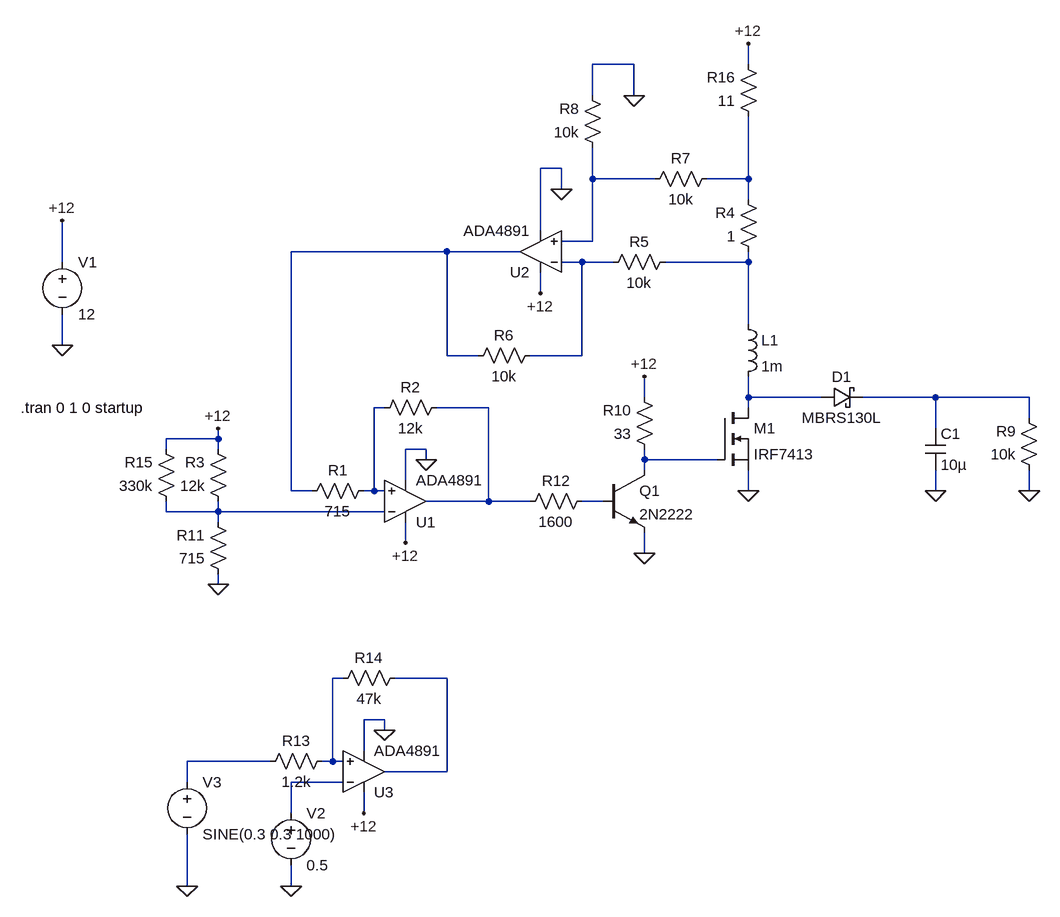
[diagram p0: schematic QuantumDriver.asc]
QuantumDriver.asc, the LTspice schematic file:
Version 4.1
SHEET 1 2180 868
WIRE 1056 -416 992 -416
WIRE 1232 -416 1232 -448
WIRE 992 -368 992 -416
WIRE 1056 -368 1056 -416
WIRE 944 -256 912 -256
WIRE 992 -240 992 -288
WIRE 1088 -240 992 -240
WIRE 1232 -240 1232 -336
WIRE 1232 -240 1168 -240
WIRE 944 -224 944 -256
WIRE 1232 -208 1232 -240
WIRE 912 -160 912 -256
WIRE 992 -144 992 -240
WIRE 992 -144 944 -144
WIRE 768 -128 528 -128
WIRE 880 -128 768 -128
WIRE 176 -112 176 -176
WIRE 976 -112 944 -112
WIRE 1024 -112 976 -112
WIRE 1232 -112 1232 -128
WIRE 1232 -112 1104 -112
WIRE 912 -64 912 -96
WIRE 1232 -16 1232 -112
WIRE 176 16 176 -32
WIRE 768 32 768 -128
WIRE 816 32 768 32
WIRE 976 32 976 -112
WIRE 976 32 896 32
WIRE 1072 96 1072 64
WIRE 1232 96 1232 64
WIRE 1344 96 1232 96
WIRE 1520 96 1408 96
WIRE 1664 96 1520 96
WIRE 672 112 656 112
WIRE 832 112 752 112
WIRE 1232 112 1232 96
WIRE 1664 128 1664 96
WIRE 1520 144 1520 96
WIRE 416 160 416 144
WIRE 416 160 336 160
WIRE 336 176 336 160
WIRE 416 176 416 160
WIRE 736 176 704 176
WIRE 736 192 736 176
WIRE 1072 192 1072 176
WIRE 1184 192 1072 192
WIRE 1072 208 1072 192
WIRE 704 224 704 176
WIRE 528 240 528 -128
WIRE 560 240 528 240
WIRE 656 240 656 112
WIRE 656 240 640 240
WIRE 672 240 656 240
WIRE 1232 240 1232 208
WIRE 1520 240 1520 208
WIRE 1664 240 1664 208
WIRE 832 256 832 112
WIRE 832 256 736 256
WIRE 896 256 832 256
WIRE 1008 256 976 256
WIRE 336 272 336 256
WIRE 416 272 416 256
WIRE 416 272 336 272
WIRE 672 272 416 272
WIRE 416 288 416 272
WIRE 704 320 704 288
WIRE 1072 336 1072 304
WIRE 416 384 416 368
WIRE 608 528 592 528
WIRE 768 528 688 528
WIRE 672 592 640 592
WIRE 672 608 672 592
WIRE 640 640 640 592
WIRE 496 656 368 656
WIRE 592 656 592 528
WIRE 592 656 576 656
WIRE 608 656 592 656
WIRE 768 672 768 528
WIRE 768 672 672 672
WIRE 368 688 368 656
WIRE 608 688 528 688
WIRE 528 736 528 688
WIRE 640 736 640 704
WIRE 368 848 368 768
WIRE 528 848 528 816
FLAG 736 192 0
FLAG 176 16 0
FLAG 176 -176 +12
FLAG 704 320 +12
FLAG 1232 240 0
FLAG 1232 -448 +12
FLAG 912 -64 +12
FLAG 944 -224 0
FLAG 1056 -368 0
FLAG 1520 240 0
FLAG 1664 240 0
FLAG 416 144 +12
FLAG 416 384 0
FLAG 1072 64 +12
FLAG 1072 336 0
FLAG 672 608 0
FLAG 640 736 +12
FLAG 528 848 0
FLAG 368 848 0
SYMBOL voltage 176 -128 R0
WINDOW 123 0 0 Left 0
WINDOW 39 0 0 Left 0
SYMATTR InstName V1
SYMATTR Value 12
SYMBOL res 656 224 R90
WINDOW 0 0 56 VBottom 2
WINDOW 3 32 56 VTop 2
SYMATTR InstName R1
SYMATTR Value 715
SYMBOL res 768 96 R90
WINDOW 0 0 56 VBottom 2
WINDOW 3 32 56 VTop 2
SYMATTR InstName R2
SYMATTR Value 12k
SYMBOL OpAmps\\ADA4891 704 320 M180
SYMATTR InstName U1
SYMBOL nmos 1184 112 R0
SYMATTR InstName M1
SYMATTR Value IRF7413
SYMBOL ind 1216 -32 R0
SYMATTR InstName L1
SYMATTR Value 1m
SYMATTR SpiceLine Rser=1m
SYMBOL res 1248 -112 R180
WINDOW 0 36 76 Left 2
WINDOW 3 36 40 Left 2
SYMATTR InstName R4
SYMATTR Value 1
SYMBOL OpAmps\\ADA4891 912 -64 R180
SYMATTR InstName U2
SYMBOL res 1120 -128 R90
WINDOW 0 0 56 VBottom 2
WINDOW 3 32 56 VTop 2
SYMATTR InstName R5
SYMATTR Value 10k
SYMBOL res 912 16 R90
WINDOW 0 0 56 VBottom 2
WINDOW 3 32 56 VTop 2
SYMATTR InstName R6
SYMATTR Value 10k
SYMBOL res 1184 -256 R90
WINDOW 0 0 56 VBottom 2
WINDOW 3 32 56 VTop 2
SYMATTR InstName R7
SYMATTR Value 10k
SYMBOL res 1008 -272 R180
WINDOW 0 36 76 Left 2
WINDOW 3 36 40 Left 2
SYMATTR InstName R8
SYMATTR Value 10k
SYMBOL schottky 1344 112 R270
WINDOW 0 32 32 VTop 2
WINDOW 3 0 32 VBottom 2
SYMATTR InstName D1
SYMATTR Value MBRS130L
SYMATTR Description Diode
SYMATTR Type diode
SYMBOL cap 1504 144 R0
SYMATTR InstName C1
SYMATTR Value 10µ
SYMBOL res 1680 224 R180
WINDOW 0 36 76 Left 2
WINDOW 3 36 40 Left 2
SYMATTR InstName R9
SYMATTR Value 10k
SYMBOL res 432 272 R180
WINDOW 0 36 76 Left 2
WINDOW 3 36 40 Left 2
SYMATTR InstName R3
SYMATTR Value 12k
SYMBOL res 432 384 R180
WINDOW 0 36 76 Left 2
WINDOW 3 36 40 Left 2
SYMATTR InstName R11
SYMATTR Value 715
SYMBOL npn 1008 208 R0
SYMATTR InstName Q1
SYMATTR Value 2N2222
SYMBOL res 1088 192 R180
WINDOW 0 36 76 Left 2
WINDOW 3 36 40 Left 2
SYMATTR InstName R10
SYMATTR Value 33
SYMBOL res 880 272 R270
WINDOW 0 32 56 VTop 2
WINDOW 3 0 56 VBottom 2
SYMATTR InstName R12
SYMATTR Value 1600
SYMBOL res 592 640 R90
WINDOW 0 0 56 VBottom 2
WINDOW 3 32 56 VTop 2
SYMATTR InstName R13
SYMATTR Value 1.2k
SYMBOL res 704 512 R90
WINDOW 0 0 56 VBottom 2
WINDOW 3 32 56 VTop 2
SYMATTR InstName R14
SYMATTR Value 47k
SYMBOL OpAmps\\ADA4891 640 736 M180
SYMATTR InstName U3
SYMBOL voltage 528 720 R0
WINDOW 123 0 0 Left 0
WINDOW 39 0 0 Left 0
SYMATTR InstName V2
SYMATTR Value 0.5
SYMBOL voltage 368 672 R0
WINDOW 123 0 0 Left 0
WINDOW 39 0 0 Left 0
SYMATTR InstName V3
SYMATTR Value SINE(0.3 0.3 1000)
SYMBOL res 352 272 R180
WINDOW 0 36 76 Left 2
WINDOW 3 36 40 Left 2
SYMATTR InstName R15
SYMATTR Value 330k
SYMBOL res 1248 -320 R180
WINDOW 0 36 76 Left 2
WINDOW 3 36 40 Left 2
SYMATTR InstName R16
SYMATTR Value 11
TEXT 112 112 Left 2 !.tran 0 1 0 startup

The netlist it stands for:
* QuantumDriver.asc
V1 +12 0 12
R1 N008 N003 715
R2 N009 N008 12k
X§U1 N008 N012 +12 0 N009 ADA4891-1  ; pins In+ In- V+ V- OUT
M1 N006 N010 0 0 IRF7413
L1 N005 N006 1m Rser=1m
R4 N005 N002 1
X§U2 N001 N004 +12 0 N003 ADA4891-1  ; pins In+ In- V+ V- OUT
R5 N005 N004 10k
R6 N004 N003 10k
R7 N002 N001 10k
R8 N001 0 10k
D1 N006 N007 MBRS130L
C1 N007 0 10µ
R9 0 N007 10k
R3 N012 +12 12k
R11 0 N012 715
Q1 N010 N011 0 0 2N2222
R10 N010 +12 33
R12 N009 N011 1600
R13 N013 N015 1.2k
R14 N014 N013 47k
X§U3 N013 N016 +12 0 N014 ADA4891-1  ; pins In+ In- V+ V- OUT
V2 N016 0 0.5
V3 N015 0 SINE(0.3 0.3 1000)
R15 N012 +12 330k
R16 N002 +12 11
.model D D
.lib standard.dio
.model NPN NPN
.model PNP PNP
.lib standard.bjt
.model NMOS NMOS
.model PMOS PMOS
.lib standard.mos
.tran 0 1 0 startup
.lib ADA4891-1.lib
.backanno
.end